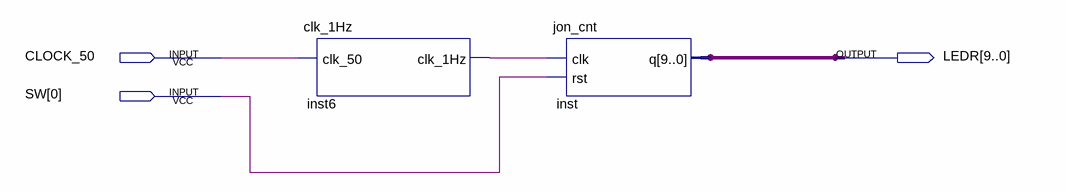
[diagram p0: schematic sheet]
// Quartus schematic j_cnt.bdf as structural Verilog: 2 symbols, 3 pins
module j_cnt (
  input  CLOCK_50,
  input  [0:0] SW,
  output [9:0] LEDR
);

  wire inst6_clk_1hz;

  clk_1Hz inst6 (.clk_50(CLOCK_50), .clk_1Hz(inst6_clk_1hz));
  jon_cnt inst (.clk(inst6_clk_1hz), .rst(SW[0]), .q(LEDR));
endmodule
